# Altium project Piezo_Micropump_Driver_Project.PrjPcb
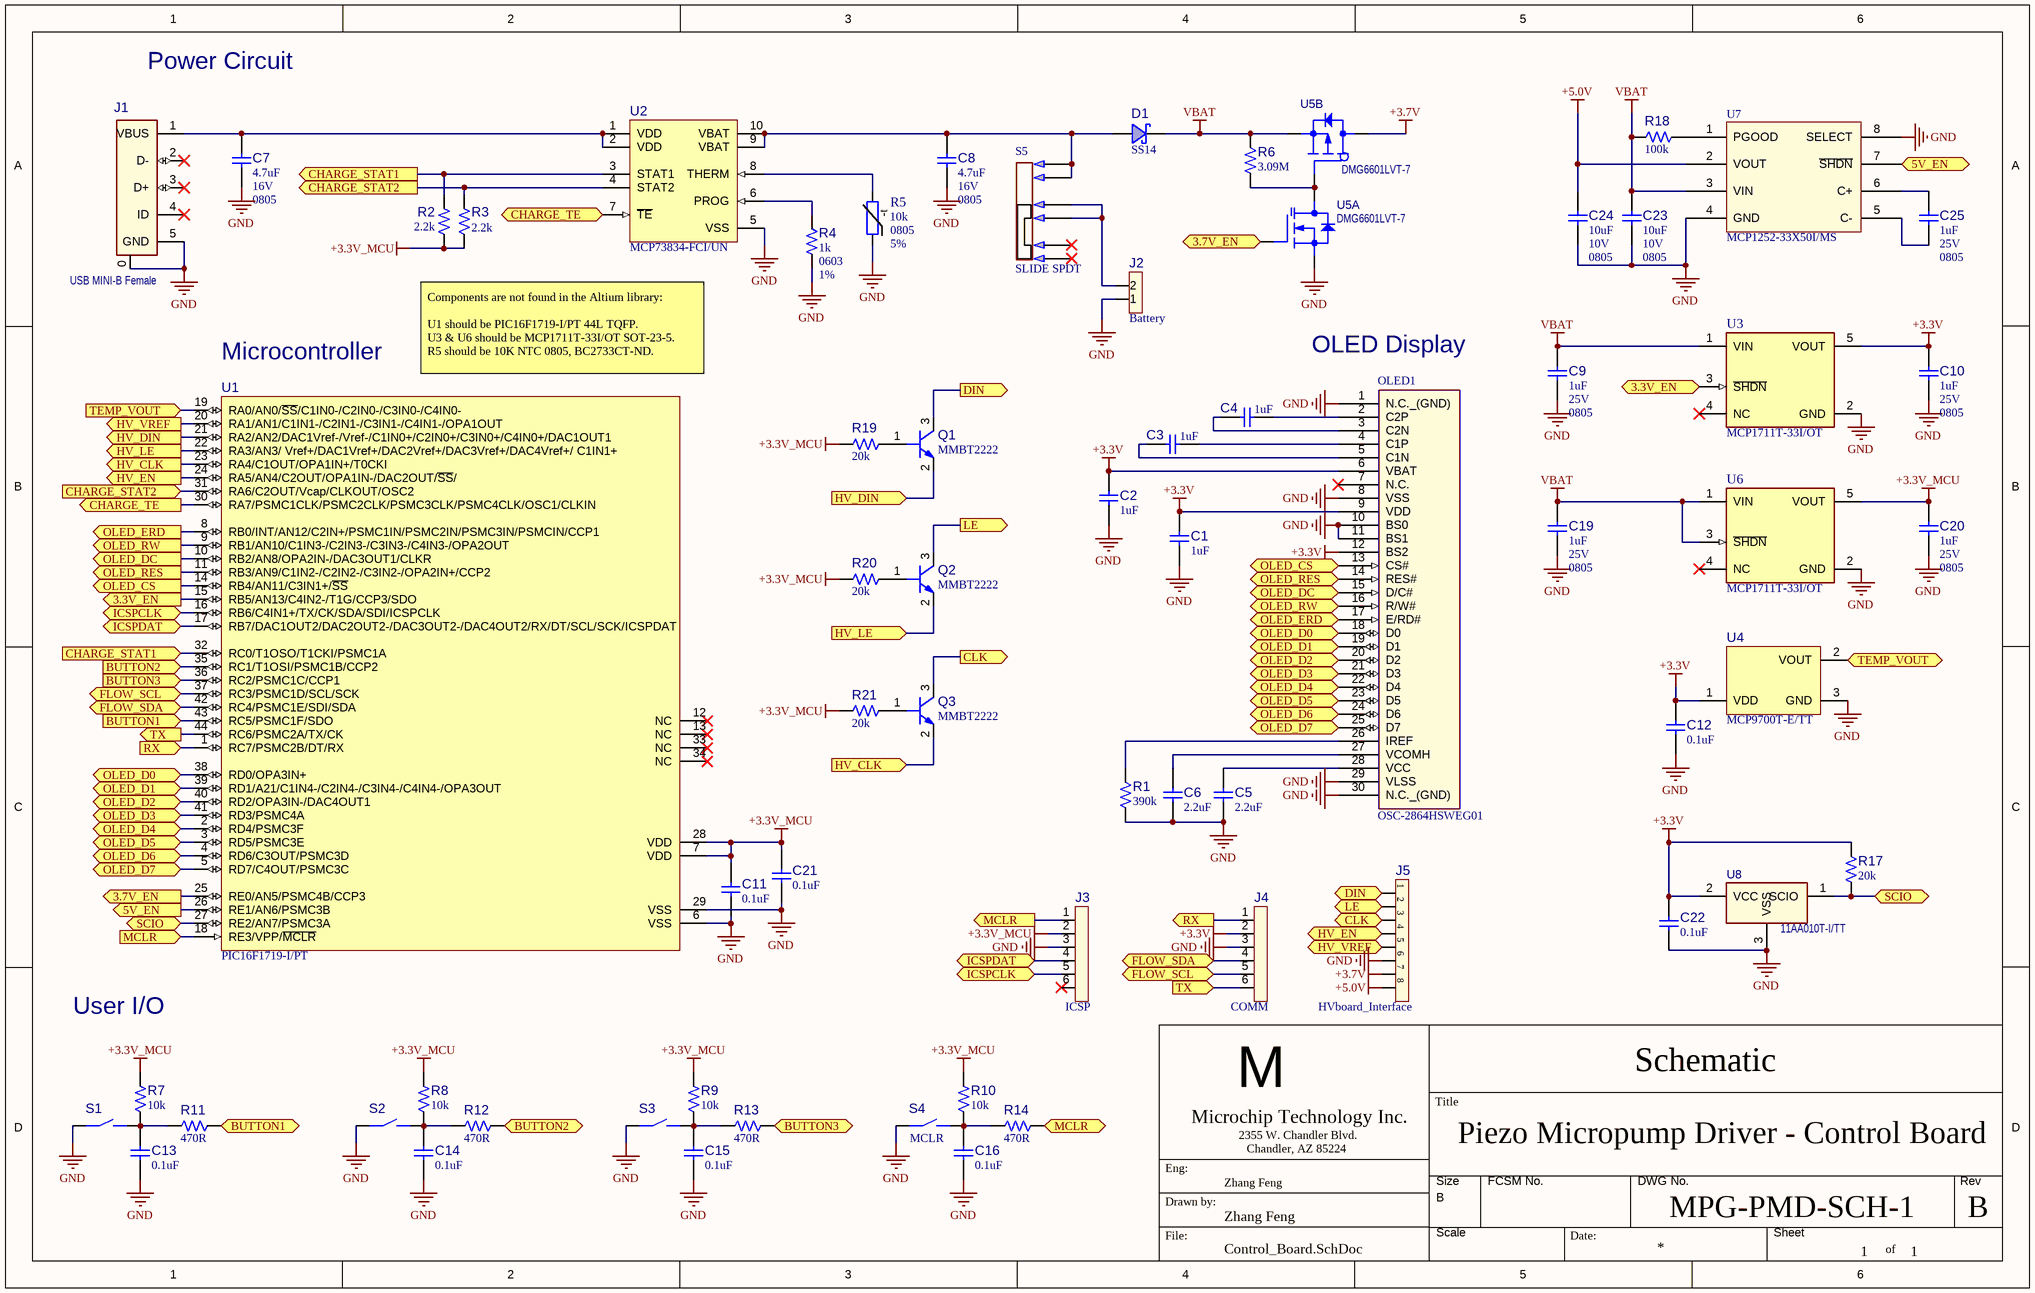
[diagram p0: Control_Board.SchDoc]
1 sheet, 65 parts. Net scope: flat (ports and power ports of the same name join across sheets).
Board file: Control_Board.PcbDoc

## Sheet Control_Board.SchDoc: Piezo Micropump Driver - Control Board
size B; DrawnBy: Zhang Feng; Engineer: Zhang Feng; Organization: Microchip Technology Inc.; Address1: 2355 W. Chandler Blvd.; Address2: Chandler, AZ 85224; DocumentNumber: MPG-PMD-SCH-1; Revision: B; SheetNumber: 1; SheetTotal: 1; DocumentType: Schematic

### Parts
C1  value 1uF  [CAP_C_0603]  (hidden comment: Capacitor NP)
C2  value 1uF  [CAP_C_0603]  (hidden comment: Capacitor NP)
C3  value 1uF  [CAP_C_0603]  (hidden comment: Capacitor NP)
C4  value 1uF  [CAP_C_0603]  (hidden comment: Capacitor NP)
C5  value 2.2uF  [CAP_C_0603]  (hidden comment: Capacitor NP)
C6  value 2.2uF  [CAP_C_0603]  (hidden comment: Capacitor NP)
C7  value 4.7uF  Voltage: 16V  Package: 0805  [CAP_C_0805]  (hidden comment: Capacitor NP)
C8  value 4.7uF  Voltage: 16V  Package: 0805  [CAP_C_0805]  (hidden comment: Capacitor NP)
C9  value 1uF  Voltage: 25V  Package: 0805  [CAP_C_0805]  (hidden comment: Capacitor NP)
C10  value 1uF  Voltage: 25V  Package: 0805  [CAP_C_0805]  (hidden comment: Capacitor NP)
C11  value 0.1uF  [CAP_C_0603]  (hidden comment: Capacitor NP)
C12  value 0.1uF  [CAP_C_0603]  (hidden comment: Capacitor NP)
C13  value 0.1uF  [CAP_C_0603]  (hidden comment: Capacitor NP)
C14  value 0.1uF  [CAP_C_0603]  (hidden comment: Capacitor NP)
C15  value 0.1uF  [CAP_C_0603]  (hidden comment: Capacitor NP)
C16  value 0.1uF  [CAP_C_0603]  (hidden comment: Capacitor NP)
C19  value 1uF  Voltage: 25V  Package: 0805  [CAP_C_0805]  (hidden comment: Capacitor NP)
C20  value 1uF  Voltage: 25V  Package: 0805  [CAP_C_0805]  (hidden comment: Capacitor NP)
C21  value 0.1uF  [CAP_C_0603]  (hidden comment: Capacitor NP)
C22  value 0.1uF  [CAP_C_0603]  (hidden comment: Capacitor NP)
C23  value 10uF  Voltage: 10V  Package: 0805  [CAP_C_0805]  (hidden comment: Capacitor NP)
C24  value 10uF  Voltage: 10V  Package: 0805  [CAP_C_0805]  (hidden comment: Capacitor NP)
C25  value 1uF  Voltage: 25V  Package: 0805  [CAP_C_0805]  (hidden comment: Capacitor NP)
D1  value SS14  [DO-214AC_SMA]  (hidden comment: Diode Schottky)
J1  value USB MINI-B Female  [CON_USB-B_Mini_SMD_RA_HIR_UX60-MB-5ST]  (hidden comment: USB_mini_B)
J2  Battery  [HDR_M_2_1X2_SMD_RA]
J3  ICSP  [HDR_M_2.54_1x6]
J4  COMM  [HDR_M_2.54_1x6]
J5  HVboard_Interface  [HDR_M_2.54_1x8_RA]
OLED1  value OSC-2864HSWEG01  [OLED_2864HSWEG01]  (hidden comment: OLED_2864HSWEG01)
Q1  value MMBT2222  [SOT-23-3]  (hidden comment: Transistor NPN BEC)
Q2  value MMBT2222  [SOT-23-3]  (hidden comment: Transistor NPN BEC)
Q3  value MMBT2222  [SOT-23-3]  (hidden comment: Transistor NPN BEC)
R1  value 390k  [RES_C_0603]  (hidden comment: Resistor)
R2  value 2.2k  [RES_C_0603]  (hidden comment: Resistor)
R3  value 2.2k  [RES_C_0603]  (hidden comment: Resistor)
R4  value 1k  Package: 0603  Tolerance: 1%  [RES_C_0603]  (hidden comment: Resistor)
R5  10k  Package: 0805  Tolerance: 5%  [RES_C_0805]
R6  value 3.09M  [RES_C_0603]  (hidden comment: Resistor)
R7  value 10k  [RES_C_0603]  (hidden comment: Resistor)
R8  value 10k  [RES_C_0603]  (hidden comment: Resistor)
R9  value 10k  [RES_C_0603]  (hidden comment: Resistor)
R10  value 10k  [RES_C_0603]  (hidden comment: Resistor)
R11  value 470R  [RES_C_0603]  (hidden comment: Resistor)
R12  value 470R  [RES_C_0603]  (hidden comment: Resistor)
R13  value 470R  [RES_C_0603]  (hidden comment: Resistor)
R14  value 470R  [RES_C_0603]  (hidden comment: Resistor)
R17  value 20k  [RES_C_0603]  (hidden comment: Resistor)
R18  value 100k  [RES_C_0603]  (hidden comment: Resistor)
R19  value 20k  [RES_C_0603]  (hidden comment: Resistor)
R20  value 20k  [RES_C_0603]  (hidden comment: Resistor)
R21  value 20k  [RES_C_0603]  (hidden comment: Resistor)
S1  Switch 2 Pin  [SW_TACT_SMD_CK_KSR231GLFS]  (value not drawn)
S2  Switch 2 Pin  [SW_TACT_SMD_CK_KSR231GLFS]  (value not drawn)
S3  Switch 2 Pin  [SW_TACT_SMD_CK_KSR231GLFS]  (value not drawn)
S4  MCLR  [SW_TACT_SMD_CK_KSR231GLFS]
S5  value SLIDE SPDT  [SW_SLIDE_TH_ESW_EG1271]  (hidden comment: Switch 6 Pin SPDT)
U1  PIC16F1719-I/PT  [TQFP-44_10x10]
U2  Supplier Part Number 1: MCP73834-FCI/UN  [MSOP-10]  (hidden comment: MCP73834)
U3  MCP1711T-33I/OT  [SOT-23-5]
U4  Manufacturer Part Number 1: MCP9700T-E/TT  [SOT-23-3]  (hidden comment: MCP9700)
U5  Manufacturer Part Number 1: DMG6601LVT-7  [TSOT26]  (hidden comment: MOSFET N/P-CH 30V 26TSOT)  (parts A,B of 2)
U6  MCP1711T-33I/OT  [SOT-23-5]
U7  Manufacturer Part Number 1: MCP1252-33X50I/MS  [MSOP-8]  (hidden comment: MCP1252)
U8  11AA010  [SOT-23-3]  (value not drawn)

### Ports
3.3V_EN (in), 3.3V_EN (out), 3.7V_EN (in), 3.7V_EN (out), 5V_EN (in), 5V_EN (out), BUTTON1 (in), BUTTON1 (out), BUTTON2 (in), BUTTON2 (out), BUTTON3 (in), BUTTON3 (out), CHARGE_STAT1 (in), CHARGE_STAT1 (out), CHARGE_STAT2 (in), CHARGE_STAT2 (out), CHARGE_TE (in), CHARGE_TE (out), CLK (in), CLK (out), DIN (in), DIN (out), FLOW_SCL (bidir), FLOW_SDA (bidir), HV_CLK (in), HV_CLK (out), HV_DIN (in), HV_DIN (out), HV_EN (in), HV_EN (out), HV_LE (in), HV_LE (out), HV_VREF (in), HV_VREF (out), ICSPCLK (bidir), ICSPDAT (bidir), LE (in), LE (out), MCLR (in), MCLR (out), OLED_CS (in), OLED_CS (out), OLED_D0 (bidir), OLED_D1 (bidir), OLED_D2 (bidir), OLED_D3 (bidir), OLED_D4 (bidir), OLED_D5 (bidir), OLED_D6 (bidir), OLED_D7 (bidir), OLED_DC (in), OLED_DC (out), OLED_ERD (in), OLED_ERD (out), OLED_RES (in), OLED_RES (out), OLED_RW (in), OLED_RW (out), RX (in), RX (out), SCIO (bidir), TEMP_VOUT (in), TEMP_VOUT (out), TX (in), TX (out)

### Nets
+3.3V: C1.2 C2.2 C10.2 C12.2 C22.2 J4.2 OLED1.6(VBAT) OLED1.9(VDD) OLED1.12(BS2) R17.2 U3.5(VOUT) U4.1(VDD) U8.2(VCC)
+3.3V_MCU: C11.2 C20.2 C21.2 J3.2 R2.1 R3.1 R7.2 R8.2 R9.2 R10.2 R19.1 R20.1 R21.1 U1.7(VDD) U1.28(VDD) U6.5(VOUT)
+3.7V: J5.7 U5.4(D2_(P))
+5.0V: C24.2 J5.8 U7.2(VOUT)
GND: C1.1 C2.1 C5.1 C6.1 C7.1 C8.1 C9.1 C10.1 C11.1 C12.1 C13.1 C14.1 C15.1 C16.1 C19.1 C20.1 C21.1 C22.1 C23.1 C24.1 J1.0(Shield) J1.5(GND) J2.1 J3.3 J4.3 J5.6 OLED1.1(N.C._(GND)) OLED1.8(VSS) OLED1.10(BS0) OLED1.11(BS1) OLED1.29(VLSS) OLED1.30(N.C._(GND)) R1.1 R4.1 R5.1 S1.1 S2.1 S3.1 S4.1 U1.6(VSS) U1.29(VSS) U2.5(VSS) U3.2(GND) U4.3(GND) U5.5(S1_(N)) U6.2(GND) U7.4(GND) U7.8(SELECT) U8.3(VSS)
VBAT: C9.2 C19.2 C23.2 D1.2(K) R6.2 R18.1 U3.1(VIN) U5.2(S2_(P)) U6.1(VIN) U6.3(~{SHDN}) U7.3(VIN)
NetC3_1: C3.1 OLED1.5(C1N)
NetC3_2: C3.2 OLED1.4(C1P)
NetC4_1: C4.1 OLED1.3(C2N)
NetC4_2: C4.2 OLED1.2(C2P)
NetC5_2: C5.2 OLED1.28(VCC)
NetC6_2: C6.2 OLED1.27(VCOMH)
NetC7_2: C7.2 J1.1(VBUS) U2.1(VDD) U2.2(VDD)
NetC8_2: C8.2 D1.1(A) S5.3 S5.6 U2.9(VBAT) U2.10(VBAT)
NetC13_2: C13.2 R7.1 R11.1 S1.2
NetC14_2: C14.2 R8.1 R12.1 S2.2
NetC15_2: C15.2 R9.1 R13.1 S3.2
NetC16_2: C16.2 R10.1 R14.1 S4.2
NetC25_1: C25.1 U7.5(C-)
NetC25_2: C25.2 U7.6(C+)
NetJ2_2: J2.2 S5.2 S5.5
NetJ3_1: J3.1 R14.2 U1.18(RE3/VPP/~{MCLR}) ; port MCLR
NetJ3_4: J3.4 U1.17(RB7/DAC1OUT2/DAC2OUT2-/DAC3OUT2-/DAC4OUT2/RX/DT/SCL/SCK/ICSPDAT) ; port ICSPDAT
NetJ3_5: J3.5 U1.16(RB6/C4IN1+/TX/CK/SDA/SDI/ICSPCLK) ; port ICSPCLK
NetJ4_1: J4.1 U1.1(RC7/PSMC2B/DT/RX) ; port RX
NetJ4_4: J4.4 U1.42(RC4/PSMC1E/SDI/SDA) ; port FLOW_SDA
NetJ4_5: J4.5 U1.37(RC3/PSMC1D/SCL/SCK) ; port FLOW_SCL
NetJ4_6: J4.6 U1.44(RC6/PSMC2A/TX/CK) ; port TX
NetJ5_1: J5.1 Q1.3(C) ; port DIN
NetJ5_2: J5.2 Q2.3(C) ; port LE
NetJ5_3: J5.3 Q3.3(C) ; port CLK
NetJ5_4: J5.4 U1.24(RA5/AN4/C2OUT/OPA1IN-/DAC2OUT/~{SS}/) ; port HV_EN
NetJ5_5: J5.5 U1.20(RA1/AN1/C1IN1-/C2IN1-/C3IN1-/C4IN1-/OPA1OUT) ; port HV_VREF
NetOLED1_13: OLED1.13(CS#) U1.14(RB4/AN11/C3IN1+/~{SS}) ; port OLED_CS
NetOLED1_14: OLED1.14(RES#) U1.11(RB3/AN9/C1IN2-/C2IN2-/C3IN2-/OPA2IN+/CCP2) ; port OLED_RES
NetOLED1_15: OLED1.15(D/C#) U1.10(RB2/AN8/OPA2IN-/DAC3OUT1/CLKR) ; port OLED_DC
NetOLED1_16: OLED1.16(R/W#) U1.9(RB1/AN10/C1IN3-/C2IN3-/C3IN3-/C4IN3-/OPA2OUT) ; port OLED_RW
NetOLED1_17: OLED1.17(E/RD#) U1.8(RB0/INT/AN12/C2IN+/PSMC1IN/PSMC2IN/PSMC3IN/PSMCIN/CCP1) ; port OLED_ERD
NetOLED1_18: OLED1.18(D0) U1.38(RD0/OPA3IN+) ; port OLED_D0
NetOLED1_19: OLED1.19(D1) U1.39(RD1/A21/C1IN4-/C2IN4-/C3IN4-/C4IN4-/OPA3OUT) ; port OLED_D1
NetOLED1_20: OLED1.20(D2) U1.40(RD2/OPA3IN-/DAC4OUT1) ; port OLED_D2
NetOLED1_21: OLED1.21(D3) U1.41(RD3/PSMC4A) ; port OLED_D3
NetOLED1_22: OLED1.22(D4) U1.2(RD4/PSMC3F) ; port OLED_D4
NetOLED1_23: OLED1.23(D5) U1.3(RD5/PSMC3E) ; port OLED_D5
NetOLED1_24: OLED1.24(D6) U1.4(RD6/C3OUT/PSMC3D) ; port OLED_D6
NetOLED1_25: OLED1.25(D7) U1.5(RD7/C4OUT/PSMC3C) ; port OLED_D7
NetOLED1_26: OLED1.26(IREF) R1.2
NetQ1_1: Q1.1(B) R19.2
NetQ1_2: Q1.2(E) U1.21(RA2/AN2/DAC1Vref-/Vref-/C1IN0+/C2IN0+/C3IN0+/C4IN0+/DAC1OUT1) ; port HV_DIN
NetQ2_1: Q2.1(B) R20.2
NetQ2_2: Q2.2(E) U1.22(RA3/AN3/_Vref+/DAC1Vref+/DAC2Vref+/DAC3Vref+/DAC4Vref+/_C1IN1+) ; port HV_LE
NetQ3_1: Q3.1(B) R21.2
NetQ3_2: Q3.2(E) U1.23(RA4/C1OUT/OPA1IN+/T0CKI) ; port HV_CLK
NetR2_2: R2.2 U1.32(RC0/T1OSO/T1CKI/PSMC1A) U2.3(STAT1) ; port CHARGE_STAT1
NetR3_2: R3.2 U1.31(RA6/C2OUT/Vcap/CLKOUT/OSC2) U2.4(STAT2) ; port CHARGE_STAT2
NetR4_2: R4.2 U2.6(PROG)
NetR5_2: R5.2 U2.8(THERM)
NetR6_1: R6.1 U5.3(G2_(P)) U5.6(D1_(N))
NetR11_2: R11.2 U1.43(RC5/PSMC1F/SDO) ; port BUTTON1
NetR12_2: R12.2 U1.35(RC1/T1OSI/PSMC1B/CCP2) ; port BUTTON2
NetR13_2: R13.2 U1.36(RC2/PSMC1C/CCP1) ; port BUTTON3
NetR17_1: R17.1 U1.27(RE2/AN7/PSMC3A) U8.1(SCIO) ; port SCIO
NetR18_2: R18.2 U7.1(PGOOD)
NetU1_15: U1.15(RB5/AN13/C4IN2-/T1G/CCP3/SDO) U3.3(~{SHDN}) ; port 3.3V_EN
NetU1_19: U1.19(RA0/AN0/~{SS}/C1IN0-/C2IN0-/C3IN0-/C4IN0-) U4.2(VOUT) ; port TEMP_VOUT
NetU1_25: U1.25(RE0/AN5/PSMC4B/CCP3) U5.1(G1_(N)) ; port 3.7V_EN
NetU1_26: U1.26(RE1/AN6/PSMC3B) U7.7(~{SHDN}) ; port 5V_EN
NetU1_30: U1.30(RA7/PSMC1CLK/PSMC2CLK/PSMC3CLK/PSMC4CLK/OSC1/CLKIN) U2.7(~{TE}) ; port CHARGE_TE

Not connected (* = marked no-connect by the designer): J1 2(D-)* 3(D+)* 4(ID)*; J3 6*; OLED1 7(N.C.)*; S5 1* 4*; U1 12(NC)* 13(NC)* 33(NC)* 34(NC)*; U3 4(NC)*; U6 4(NC)*

### Notes on the sheet
- Power Circuit
- (near U1) Microcontroller
- Components are not found in the Altium library:
  U1 should be PIC16F1719-I/PT 44L TQFP.
  U3 & U6 should be MCP1711T-33I/OT SOT-23-5.
  R5 should be 10K NTC 0805, BC2733CT-ND.
- (near OLED1) OLED Display
- User I/O
- (near J4) M
- Title
- Eng:
- File:
- Drawn by:
- Date:
- of
- (in symbol RES1425) -t

### Library data of the parts
C1-C4 = CAP0517: Capacitor; Manufacturer 1: Taiyo Yuden; Manufacturer Part Number 1: EMK107B7105KA-T; Voltage: 16V; Description_: CAP CER 1uF 16V 10% X7R SMD 0603; Tolerance: 10%; Temperature Coeffcient: X7R; Type: Ceramic; Populated: Yes; MCHP-ID: CAP0517; Package: 0603; Revision: 1; Status: Production; ComponentLink1URL: https://chn-vm-apps.microchip.com/mchprepo/parts/Datasheets/mlcc01_e.pdf; ComponentLink1Description: Datasheet; Operating Temperature: -55C to +125C; Category: Capacitor; Manufacturer 2: TDK; Manufacturer Part Number 2: C1608X7R1C105K; Supplier 1: Digi-Key; Supplier Part Number 1: 587-1241-1-ND; Supplier 2: Digi-Key; Supplier Part Number 2: 445-1604-1-ND; Quantity Override: 1
C5 C6 = CAP0597: Capacitor; Manufacturer 1: TDK; Manufacturer Part Number 1: C1608X5R1C225K; Voltage: 16V; Description_: CAP CER 2.2uF 16V 10% X5R SMD 0603; Tolerance: 10%; Temperature Coeffcient: X5R; Type: Ceramic; Populated: Yes; MCHP-ID: CAP0597; Package: 0603; Revision: 2; Status: Production; ComponentLink1URL: https://chn-vm-apps.microchip.com/mchprepo/parts/Datasheets/general_B11.pdf; ComponentLink1Description: Datasheet; Operating Temperature: -55C to +85C; Category: Capacitor; Supplier 1: Digi-Key; Supplier Part Number 1: 445-5157-1-ND; Quantity Override: 1
C7 C8 = CAP0419: Capacitor; Manufacturer 1: Panasonic; Manufacturer Part Number 1: ECJ-2FF1C475Z; Description_: CAP CER 4.7uF 16V 20% Y5V SMD 0805; Tolerance: 20%; Temperature Coeffcient: Y5V; Type: Ceramic; Populated: Yes; MCHP-ID: CAP0419; Revision: 1; Status: Production; ComponentLink1URL: https://chn-vm-apps.microchip.com/mchprepo/parts/Datasheets/ECJ__General_.pdf; ComponentLink1Description: Datasheet; Operating Temperature: -30C to +85C; Category: Capacitor; Supplier 1: Digi-Key; Supplier Part Number 1: PCC2232TR-ND; Quantity Override: 1
C9 C10 C19 C20 C25 = CAP1211: Capacitor; Manufacturer 1: AVX; Manufacturer Part Number 1: 08053C105K4Z2A; Description_: CAP CER 1uF 25V 10% X7R SMD 0805; Tolerance: 10%; Temperature Coeffcient: X7R; Type: Ceramic; Owner: Tad Ahlvers; Populated: YES; MCHP-ID: CAP1211; Revision: 1; Status: MCL Design; ComponentLink1URL: https://chn-vm-apps.microchip.com/mchprepo/parts/Datasheets/flexiterm.pdf; ComponentLink1Description: Datasheet; Operating Temperature: -55C to +125C; Category: Capacitor; Manufacturer 2: KEMET; Manufacturer Part Number 2: C0805C105K3RACTU; Manufacturer 3: TDK Corporation; Manufacturer Part Number 3: C2012X7R1E105K125AB; Supplier 1: Digi-Key; Supplier Part Number 1: 478-6357-2-ND; Supplier 2: Digi-Key; Supplier Part Number 2: C0805C105K3RACTU-ND; Supplier 3: Digi-Key; Supplier Part Number 3: 445-1354-1-ND; Quantity Override: 1
C11-C16 C21 C22 = CAP0011: Capacitor; Manufacturer 1: AVX; Manufacturer Part Number 1: 0603YC104KAT2A; Voltage: 16V; Description_: CAP CER 0.1uF 16V 10% X7R SMD 0603; Tolerance: 10%; Temperature Coeffcient: X7R; Type: Ceramic; Populated: Yes; MCHP-ID: CAP0011; Package: 0603; Revision: 3; Status: Production; ComponentLink1URL: https://chn-vm-apps.microchip.com/mchprepo/parts/Datasheets/nmc2.pdf; ComponentLink1Description: Datasheet; Operating Temperature: -55C to +125C; Category: Capacitor; Manufacturer 2: Murata; Manufacturer Part Number 2: GRM188R71C104KA01D; Manufacturer 3: Panasonic; Manufacturer Part Number 3: ECJ-1VB1C104K; Manufacturer 4: Taiyo Yuden; Manufacturer Part Number 4: EMK107B7104KA-T; Manufacturer 5: Yageo; Manufacturer Part Number 5: CC0603KRX7R7BB104; Manufacturer 6: NIC Components; Manufacturer Part Number 6: NMC0603X7R104K16TRPF; Supplier 1: Digi-Key; Supplier Part Number 1: 478-1239-1-ND; Supplier 2: Digi-Key; Supplier Part Number 2: 490-1532-1-ND; Supplier 3: Digi-Key; Supplier Part Number 3: PCC1762CT-ND; Supplier 4: Digi-Key; Supplier Part Number 4: 587-1240-2-ND; Supplier 5: Newark; Supplier Part Number 5: 86H5248; Supplier 6: Digi-Key; Supplier Part Number 6: 311-1088-1-ND; Supplier 7: NIC Components; Supplier Part Number 7: NMC0603X7R104K16TRPF; Quantity Override: 1
C23 C24 = CAP1148: Capacitor; Manufacturer 1: TDK Corporation; Manufacturer Part Number 1: C2012X7R1A106K125AC; Description_: CAP CER 10uF 10V 10% X7R SMD 0805; Dev Tools Status: Production; Tolerance: 10%; Temperature Coeffcient: X7R; Type: Ceramic; Owner: Mihai T(M91442); Populated: Yes; MCHP-ID: CAP1148; Revision: 0; Status: MCL Design; ComponentLink1URL: https://chn-vm-apps.microchip.com/mchprepo/parts/Datasheets/L0005E.pdf; ComponentLink1Description: Datasheet; Operating Temperature: -55C to +125C; Category: Capacitor; Manufacturer 2: Murata; Manufacturer Part Number 2: GRM21BR71A106KE51L; Supplier 1: Digi-Key; Supplier Part Number 1: 445-6857-1-ND; Supplier 2: Digi-Key; Supplier Part Number 2: 490-3905-1-ND; Supplier 3: Farnell; Supplier Part Number 3: 1828828; Quantity Override: 1
D1 = DIODE0128: Manufacturer 1: Fairchild; Description_: DIO SCTKY SS14 500mV 1A 40V DO-214AC_SMA; Type: Schottky Single; Forward Current: 1A; Power: 1.1W; Reverse Current: 200uA; Reverse Voltage: 40V; Populated: YES; MCHP-ID: DIODE0128; Revision: 1; Status: Production; Package: DO-214AC_SMA; ComponentLink1URL: https://chn-vm-apps.microchip.com/mchprepo/parts/Datasheets/SS12.pdf; ComponentLink1Description: Datasheet; Operating Temperature: -65C to +125C; Category: Diode; Manufacturer Part Number 1: SS14; Supplier 1: Digi-Key; Supplier Part Number 1: SS14CT-ND; Quantity Override: 1
J1 = CON0276: Connector USB; Manufacturer 1: Hirose; Manufacturer Part Number 1: UX60-MB-5ST; Description_: CON USB MINI-B Female SMD R/A; Populated: Yes; MCHP-ID: CON0276; Revision: 2; Status: Production; ComponentLink1URL: https://chn-vm-apps.microchip.com/mchprepo/parts/Datasheets/e24000019.pdf; ComponentLink1Description: Datasheet; Type: USB; Category: Connector; Manufacturer 2: Oupiin; Manufacturer Part Number 2: 8969-B05C00DBU; Supplier 1: Digi-Key; Supplier Part Number 1: H2959CT-ND; Supplier 2: Digi-Key; Supplier Part Number 2: H2959TR-ND; Supplier 3: Oupiin; Supplier Part Number 3: 8969-B05C00DBU; Quantity Override: 1
J2 = CON1434: Manufacturer 1: JST Sales America Inc.; Manufacturer Part Number 1: S2B-PH-SM4-TB(LF)(SN); Value: CONN HDR PH SMD 2MM; Description_: CONN HDR-2 Male 1X2 SMD R/A; Dev Tools Status: Design; Owner: Jose Garcia; Populated: YES; MCHP-ID: CON1434; Revision: 1; Status: MCL Design; ComponentLink1URL: https://chn-vm-apps.microchip.com/mchprepo/parts/Datasheets/ePH; ComponentLink1Description: Datasheet; Type: Header 2mm; Category: Connector; Supplier 1: Digi-Key; Supplier Part Number 1: 455-1749-1-ND; Quantity Override: 1
J3 J4 = CON1106: Manufacturer 1: FCI; Manufacturer Part Number 1: 68001-106HLF; Value: HDR-2.54 Male 1x6; Description_: CON HDR-2.54 Male 1x6 Gold 5.84MH TH VERT; Owner: Bogdan P (M91398); Populated: Yes; MCHP-ID: CON1106; Revision: 0; Status: Production; ComponentLink1URL: https://chn-vm-apps.microchip.com/mchprepo/parts/Datasheets/68000.pdf; ComponentLink1Description: Datasheet; Type: Header 2.54mm; Category: Connector; Supplier 1: Digi-Key; Supplier Part Number 1: 609-3272-ND; Quantity Override: 1
J5 = CON1290: Manufacturer 1: Sullins Connector Solutions; Manufacturer Part Number 1: PBC08SBAN; Value: HDR-2.54 Male 1x8; Description_: CON HDR-2.54 Male 1x8 Gold 5.84MH TH R/A; Owner: Bogdan Popescu; Populated: YES; MCHP-ID: CON1290; Revision: A; Status: Design; ComponentLink1URL: https://chn-vm-apps.microchip.com/mchprepo/parts/Datasheets/97_Page78-79_HEADER_.100_2.54mm_MALE_BREAKAWAY.pdf; ComponentLink1Description: Datasheet; Type: Header 2.54mm; Category: Connector; Supplier 1: Digi-Key; Supplier Part Number 1: S1111E-08-ND; Quantity Override: 1
OLED1 = LCD0034: Manufacturer 1: OSD Displays; Description_: DISPLAY OLED OSC-2864HSWEG01 MNT; Owner: Mike Sullivan (Arena); Populated: YES; MCHP-ID: LCD0034; Revision: 0; Status: Design; ComponentLink1URL: https://chn-vm-apps.microchip.com/mchprepo/parts/Datasheets/OSD-2864HSWEG01.pdf; ComponentLink1Description: Datasheet; Operating Temperature: -30C to +70C; Type: OLED; Category: Display; Manufacturer Part Number 1: OSC-2864HSWEG01; Supplier 1: OSD Displays; Supplier Part Number 1: OSC-2864HSWEG01; Quantity Override: 1
Q1-Q3 = TRA0039: Transistor Bipolar; Manufacturer 1: Fairchild; Description_: TRANS BJT NPN MMBT2222 30V 600mA 350mW SOT-23-3; Dev Tools Status: Production; Type: BJT; Current: 600mA; Power: 350mW; Voltage: 30V; Populated: YES; MCHP-ID: TRA0039; Revision: 2; Status: MCL Design; Package: SOT-23-3; ComponentLink1URL: https://chn-vm-apps.microchip.com/mchprepo/parts/Datasheets/MMBT2222.pdf; ComponentLink1Description: Datasheet; Operating Temperature: -55C to +150C; Category: Transistor; Manufacturer Part Number 1: MMBT2222; Supplier 1: Fairchild; Supplier Part Number 1: MMBT2222; Quantity Override: 1
R1 = RSMT0758: Manufacturer 1: Panasonic; Manufacturer Part Number 1: ERJ-3EKF3903V; Tolerance: 1%; Description_: RES TKF 390k 1% 1/10W SMD 0603; Voltage: 75V; Temperature Coeffcient: 100ppm/C; Power: 1/10W; Populated: Yes; MCHP-ID: RSMT0758; Package: 0603; Revision: 1; Status: Production; ComponentLink1URL: https://chn-vm-apps.microchip.com/mchprepo/parts/Datasheets/AOA0000CE2.pdf; ComponentLink1Description: Datasheet; Operating Temperature: -55C to +155C; Category: Resistor; Type: RES SMD; Composition: TKF; Supplier 1: Digi-Key; Supplier Part Number 1: P390KHCT-ND; Quantity Override: 1
R2 R3 = RES1130: Manufacturer 1: Panasonic; Manufacturer Part Number 1: ERJ-3EKF2201V; Tolerance: 1%; Description_: RES TKF 2.2k 1% 1/10W SMD 0603; Voltage: 75V; Temperature Coeffcient: 100ppm/C; Power: 1/10W; Owner: Bogdan P (M91398); Populated: Yes; MCHP-ID: RES1130; Package: 0603; Revision: 0; Status: Production; ComponentLink1URL: https://chn-vm-apps.microchip.com/mchprepo/parts/Datasheets/AOA0000CE2.pdf; ComponentLink1Description: Datasheet; Operating Temperature: -55C to +155C; Category: Resistor; Type: RES SMD; Composition: TKF; Supplier 1: Digi-Key; Supplier Part Number 1: P2.20KHCT-ND; Quantity Override: 1
R4 = RSMT0138: Manufacturer 1: Panasonic; Manufacturer Part Number 1: ERJ-3EKF1001V; Description_: RES TKF 1k 1% 1/10W SMD 0603; Voltage: 75V; Temperature Coeffcient: 100ppm/C; Power: 1/10W; Populated: Yes; MCHP-ID: RSMT0138; Revision: 2; Status: Production; ComponentLink1URL: https://chn-vm-apps.microchip.com/mchprepo/parts/Datasheets/AOA0000CE2.pdf; ComponentLink1Description: Datasheet; Operating Temperature: -55C to +155C; Category: Resistor; Type: RES SMD; Composition: TKF; Manufacturer 2: Yageo; Manufacturer Part Number 2: RC0603FR-071KL; Manufacturer 3: ROHM; Manufacturer Part Number 3: MCR03EZPFX1001; Manufacturer 4: Stackpole Electronics Inc; Manufacturer Part Number 4: RMCF0603FT1K00; Manufacturer 5: Stackpole Electronics Inc; Manufacturer Part Number 5: RMCF 1/16 1K 1% R; Manufacturer 6: Vishay; Manufacturer Part Number 6: CRCW06031K00FKEA; Manufacturer 7: Stackpole Electronics Inc; Manufacturer Part Number 7: RMCF1/161.0K1%TR; Supplier 1: Digi-Key; Supplier Part Number 1: P1.00KHCT-ND; Supplier 2: Digi-Key; Supplier Part Number 2: P1.00KHTR-ND; Supplier 3: Digi-Key; Supplier Part Number 3: 311-1.00KHRCT-ND; Supplier 4: Digi-Key; Supplier Part Number 4: RHM1.00KHCT-ND; Supplier 5: Digi-Key; Supplier Part Number 5: RMCF1/161KFRTR-ND; Supplier 6: Digi-Key; Supplier Part Number 6: RMCF0603FT1K00TR-ND; Supplier 7: Newark; Supplier Part Number 7: 52K8015; Supplier 8: Stackpole Electronics Inc; Supplier Part Number 8: RMCF1/161.0K1%TR; Quantity Override: 1
R5 = RES1425: Manufacturer 1: Vishay BC Components; Manufacturer Part Number 1: NTCS0805E3473JHT; Value: 47k; Description_: RES THERMISTOR 47K 5% 210mW SMD 0805; Temperature Coeffcient: NTC; Circuit Type: Isolated; Power: 210mW; Owner: Stephen Humberd; Populated: YES; MCHP-ID: RES1425; Revision: B; Status: Design; ComponentLink1URL: https://chn-vm-apps.microchip.com/mchprepo/parts/Datasheets/ntcs0805e3t.pdf; ComponentLink1Description: Datasheet; Operating Temperature: -40C to +150C; Category: Resistor; Type: Thermistor; Composition: C; Supplier 1: Digi-Key; Supplier Part Number 1: BC2297CT-ND; Quantity Override: 1
R6 = RSMT1115: Manufacturer 1: Vishay Dale; Manufacturer Part Number 1: CRCW06033M09FKEA; Tolerance: 1%; Description_: RES TKF 3.09M 1% 1/10W SMD 0603; Voltage: 75V; Temperature Coeffcient: 100ppm/C; Power: 1/10W; Owner: Bogdan Popescu; Populated: YES; MCHP-ID: RSMT1115; Package: 0603; Revision: A; Status: Design; ComponentLink1URL: https://chn-vm-apps.microchip.com/mchprepo/parts/Datasheets/dcrcwe3.pdf; ComponentLink1Description: Datasheet; Operating Temperature: -55C to +155C; Category: Resistor; Type: RES SMD; Composition: TKF; Supplier 1: Digi-Key; Supplier Part Number 1: 541-3.09MHCT-ND; Quantity Override: 1
R7-R10 = RSMT0139: Manufacturer 1: Panasonic; Manufacturer Part Number 1: ERJ-3EKF1002V; Tolerance: 1%; Description_: RES TKF 10k 1% 1/10W SMD 0603; Temperature Coeffcient: 100ppm/C; Power: 1/10W; Populated: Yes; MCHP-ID: RSMT0139; Package: 0603; Revision: 2; Status: Production; ComponentLink1URL: https://chn-vm-apps.microchip.com/mchprepo/parts/Datasheets/nrc.pdf; ComponentLink1Description: Datasheet; Operating Temperature: -55C to +155C; Category: Resistor; Type: RES SMD; Composition: TKF; Manufacturer 2: Stackpole Electronics Inc; Manufacturer Part Number 2: RMCF0603FT10K0; Manufacturer 3: Yageo; Manufacturer Part Number 3: RC0603FR-0710KL; Manufacturer 4: Stackpole Electronics Inc; Manufacturer Part Number 4: RMCF 1/16 10K 1% R; Manufacturer 5: Xicon; Manufacturer Part Number 5: 302-10K-RC; Manufacturer 6: NIC Components; Manufacturer Part Number 6: NRC06F1002TRF; Supplier 1: Digi-Key; Supplier Part Number 1: P10.0KHCT-ND; Supplier 2: Digi-Key; Supplier Part Number 2: RMCF1/1610KFRTR-ND; Supplier 3: Digi-Key; Supplier Part Number 3: 311-10.0KHRCT-ND; Supplier 4: Digi-Key; Supplier Part Number 4: RMCF0603FT10K0TR-ND; Supplier 5: Mouser; Supplier Part Number 5: 302-10k-RC; Supplier 6: NIC Components; Supplier Part Number 6: NRC06F1002TRF; Quantity Override: 1
R11-R14 = RSMT0518: Manufacturer 1: Yageo; Manufacturer Part Number 1: RC0603FR-07470RL; Tolerance: 1%; Description_: RES TKF 470R 1% 1/10W SMD 0603; Voltage: 50V; Temperature Coeffcient: 100ppm/C; Power: 1/10W; Populated: Yes; MCHP-ID: RSMT0518; Package: 0603; Revision: 1; Status: Production; ComponentLink1URL: https://chn-vm-apps.microchip.com/mchprepo/parts/Datasheets/PYu-RC0603_51_RoHS_L_4.pdf; ComponentLink1Description: Datasheet; Operating Temperature: -55C to +155C; Category: Resistor; Type: RES SMD; Composition: TKF; Manufacturer 2: Panasonic; Manufacturer Part Number 2: ERJ-3EKF4700V; Manufacturer 3: Stackpole Electronics Inc; Manufacturer Part Number 3: RMCF0603FT470R; Supplier 1: Digi-Key; Supplier Part Number 1: 311-470HRCT-ND; Supplier 2: Digi-Key; Supplier Part Number 2: P470HCT-ND; Supplier 3: Digi-Key; Supplier Part Number 3: RMCF1/16470FRTR-ND; Quantity Override: 1
R17 = RSMT0309: Manufacturer 1: Yageo; Manufacturer Part Number 1: 9C06031A2002FKHFT; Tolerance: 1%; Description_: RES TKF 20k 1% 1/10W SMD 0603; Voltage: 50V; Temperature Coeffcient: 100ppm/C; Power: 1/10W; Populated: Yes; MCHP-ID: RSMT0309; Package: 0603; Revision: 1; Status: Production; ComponentLink1URL: https://chn-vm-apps.microchip.com/mchprepo/parts/Datasheets/PYu-RC0603_51_RoHS_L_4.pdf; ComponentLink1Description: Datasheet; Operating Temperature: -55C to +155C; Category: Resistor; Type: RES SMD; Composition: TKF; Manufacturer 2: Yageo; Manufacturer Part Number 2: RC0603FR-0720KL; Manufacturer 3: Yageo; Manufacturer Part Number 3: 9C06031A2002FKPFT; Manufacturer 4: Stackpole Electronics Inc; Manufacturer Part Number 4: RMCF1/1620.0K1%TR; Manufacturer 5: Panasonic; Manufacturer Part Number 5: ERJ-3EKF2002V; Supplier 1: Digi-Key; Supplier Part Number 1: 311-20.0KHTR-ND; Supplier 2: Yageo; Supplier Part Number 2: RC0603FR-0720KL; Supplier 3: Digi-Key; Supplier Part Number 3: 311-20.0KHRCT-ND; Supplier 4: Yageo; Supplier Part Number 4: 9C06031A2002FKPFT; Supplier 5: Stackpole Electronics Inc; Supplier Part Number 5: RMCF1/1620.0K1%TR; Supplier 6: Digi-Key; Supplier Part Number 6: P20.0KHCT-ND; Quantity Override: 1
R18 = RES1066: Manufacturer 1: Vishay; Manufacturer Part Number 1: MCT06030C1003FP500; Tolerance: 1%; Description_: RES TF 100k 1% 1/8W SMD 0603; Voltage: 75V; Temperature Coeffcient: 50ppm/C; Power: 1/8W; Owner: Tad Ahlvers; Populated: Yes; MCHP-ID: RES1066; Package: 0603; Revision: 1; Status: Production; ComponentLink1URL: https://chn-vm-apps.microchip.com/mchprepo/parts/Datasheets/mc_pro.pdf; ComponentLink1Description: Datasheet; Operating Temperature: -55C to +155C; Category: Resistor; Type: RES SMD; Composition: TF; Supplier 1: Digi-Key; Supplier Part Number 1: MCT0603-100K-CFTR-ND; Quantity Override: 1
R19-R21 = RSMT0309: Manufacturer 1: Panasonic; Manufacturer Part Number 1: ERJ-3EKF2002V; Tolerance: 1%; Description_: RES TKF 20k 1% 1/10W SMD 0603; Dev Tools Status: Production; Voltage: 50V; Temperature Coeffcient: 100ppm/C; Power: 1/10W; Populated: Yes; MCHP-ID: RSMT0309; Package: 0603; Revision: 1; Status: MCL Design; ComponentLink1URL: https://chn-vm-apps.microchip.com/mchprepo/parts/Datasheets/PYu-RC0603_51_RoHS_L_4.pdf; ComponentLink1Description: Datasheet; Operating Temperature: -55C to +155C; Category: Resistor; Type: RES SMD; Composition: TKF; Manufacturer 2: Yageo; Manufacturer Part Number 2: 9C06031A2002FKHFT; Manufacturer 3: Yageo; Manufacturer Part Number 3: RC0603FR-0720KL; Manufacturer 4: Stackpole Electronics Inc; Manufacturer Part Number 4: RMCF1/1620.0K1%TR; Manufacturer 5: Yageo; Manufacturer Part Number 5: 9C06031A2002FKPFT; Supplier 1: Digi-Key; Supplier Part Number 1: P20.0KHCT-ND; Supplier 2: Digi-Key; Supplier Part Number 2: 311-20.0KHTR-ND; Supplier 3: Digi-Key; Supplier Part Number 3: 311-20.0KHRCT-ND; Supplier 4: Yageo; Supplier Part Number 4: RC0603FR-0720KL; Supplier 5: Stackpole Electronics Inc; Supplier Part Number 5: RMCF1/1620.0K1%TR; Supplier 6: Yageo; Supplier Part Number 6: 9C06031A2002FKPFT; Quantity Override: 1
S1-S4 = SWITCH1040: Switch; Manufacturer 1: TE Connectivity / Alcoswitch; Value: 147873-1; Description_: SWITCH TACT SPST 24V 50mA 147873-1 SMD; Owner: Stephen Humberd; Voltage: 24V; Current: 50mA; Populated: YES; MCHP-ID: SWITCH1040; Revision: 1; Status: Production; ComponentLink1URL: https://chn-vm-apps.microchip.com/mchprepo/parts/Datasheets/NG_CD_147873_K3-196492.pdf; ComponentLink1Description: Datasheet; Category: Switch; Type: Pushbutton; Manufacturer Part Number 1: 147873-1; Supplier 1: Mouser; Supplier Part Number 1: 506-147873-1; Quantity Override: 1
S5 = SWITCH0051: Switch, Slide, SPDT, TH; Manufacturer 1: E-Switch; Manufacturer Part Number 1: EG1271; Description_: SWITCH SLIDE DPDT 30V 300mA EG1271 TH; Dev Tools Status: Production; Voltage: 30V; Current: 300mA; Populated: YES; MCHP-ID: SWITCH0051; Revision: 1; Status: MCL Design; ComponentLink1URL: https://chn-vm-apps.microchip.com/mchprepo/parts/Datasheets/EG.pdf; ComponentLink1Description: Datasheet; Operating Temperature: -20C to +70C; Category: Switch; Type: Slide; Supplier 1: Digi-Key; Supplier Part Number 1: EG1918-ND; Quantity Override: 1
U1 = MIC6241: PIC16F; Manufacturer 1: Microchip Technology; Value: PIC16F1789-I/PT; Description_: MCHP MCU 8-BIT 28K 2K PIC16F1789-I/PT 44TQFP; MAPS Description: 44-pin, 28KB Flash, 2KB RAM, 256 EEPROM, 12-bit DAC, 5-bit DAC, PSMC, OPAmp,; Owner: Jamus Griego; MPC: LECM17T4XAXX; LeadContent: Pb-FREE; TempRange: -40C to +85C; Stage: REL; PackageWidth: 10x10x1mm; PackingMedia: TRAY; ForceMinOrderQtyMult: True; MinOrderQty: 160; LeadCount: 44; Program Memory KBytes: 28; Program Memory KWords: 16; Ram: 2048; EEPROM: 256; IOPins: 36; MaxSpeed: 32; OscillatorMHz: 32 MHz, 32 kHz; Comparators: 4; ADC Channels: 14; ADCBit: 12; USART: 1; CAN: 0; DigitalTimerQty_8bit: 2; Populated: YES; MCHP-ID: MIC6241; Type: 8-Bit; Status: Design; Revision: B; Category: MCHP-Microcontroller; ComponentLink1URL: http://www.microchip.com/wwwproducts/Devices.aspx?product=PIC16F1789; ComponentLink1Description: Datasheet; Manufacturer Part Number 1: PIC16F1789-I/PT; Supplier 1: Digi-Key; Supplier Part Number 1: PIC16F1789-I/PT-ND; IntroductionDate: 2013-04-04; PackageType: TQFP; Family: Enhanced Mid-Range; DAChannels: 4; SPI: 1; I2C: 1; USBChannels: 0; Input Capture: 0; PWM Channels: 0; mtrlcntrlpwmchannels: 14; SMPS PWM Channels: 14; QEI Channels: 0; SegmentLCD: 0; CapTouchCH: 14; DigitalTimerQty_16bit: 1; DigitalTimerQty_32bit: 0; Quantity Override: 1
U2 = MIC3178: MCP738XX; Manufacturer 1: Microchip; Manufacturer Part Number 1: MCP73833-FCI/UN; Value: MCP73833; Description_: MCHP ANALOG BATTERY CHARGER MCP73833T-FCI/UN MSOP-10; MAPS Description: 1A ADVANCED SINGLE CELL, FULLY INTEGRATED LI-ION POLYMER CHANGE MANAGEMENT CONTR; MPC: DECJ27E3XAFC; LeadContent: Pb-FREE; PackingMedia: TUBE; Stage: REL; LeadCount: 10; PackageWidth: 3x3mm; ForceMinOrderQtyMult: False; MinOrderQty: 5; TempRange: -40C to +85C; tblDeviceFamilyID: 1704; NumberofLiIonCells: 1; UVLO: 3.5; VccRangeMax: 6; VccRangeMin: 3.75; VoltageRegulationTyp: 4.2, 4.35, 4.4, 4.5; VolRegAccuracy: 0.75; IoutMax: 1200; OperatingCurrentTyp: 2; ReverseDischargeCurrentTyp: 0.200000002980232; PassTransistor: INT; MaxThermalRegulation: Yes; MCHP-ID: MIC3178; Type: Battery Charger; Status: Production; Revision: 0; Category: MCHP-Analog; ComponentLink1URL: http://www.microchip.com/wwwproducts/Devices.aspx?product=MCP73833; ComponentLink1Description: Datasheet; Manufacturer 2: Microchip; Manufacturer Part Number 2: MCP73833T-FCI/UN; Supplier 1: Microchip; Supplier 2: Microchip; Supplier Part Number 2: MCP73833T-FCI/UN; IntroductionDate: 2006-09-05; PackageType: MSOP; Technology: Linear; PreconditionCharge: Yes; ChargeTermination: Yes; AutomaticRecharge: Yes; TempMonitor: Yes; ChargeSafetyTimers: Yes; StatusOutput: Yes; ShutdownMode: Yes; SupplyPresent: Yes; ChargeMonitor: Yes; Populated: Yes; Quantity Override: 1
U3 U6 = MIC6434: LDO MCP1711; Manufacturer 1: Microchip Technology; Manufacturer Part Number 1: MCP1711T-18I/OT; Value: MCP1711/1.8V; Description_: MCHP ANALOG LDO 1.8V MCP1711T-18I/OT SOT-23-5; MAPS Description: 600 nA Low Quiescent Current LDO; Owner: Sorin Stanoaia; MPC: YZ026TC7XA18; LeadContent: Pb-FREE; PackingMedia: T/R; Stage: REL; LeadCount: 5; ForceMinOrderQtyMult: True; TempRange: -40C to +85C; tblDeviceFamilyID: 5913; Comments: New device; SingleDual: Single; SHDN: Yes; ResetOutput: No; VoutMin: 1.2; OutputCurrent: 150; Accuracy: 1; OutputCapType: CER/AL/TANT; VOUTtyp: 3.3; TypicalActiveCurrent: 0.6; Dropoutvoltage: 500; MinInputVoltage: 1.4; MaxInputVoltage: 6; MCHP-ID: MIC6434; Type: LDO; Status: Production; Revision: 1; Category: MCHP-Analog; ComponentLink1URL: http://www.microchip.com/wwwproducts/Devices.aspx?product=MCP1711; ComponentLink1Description: Datasheet; Supplier 1: Digi-Key; Supplier Part Number 1: MCP1711T-18I/OTCT-ND; IntroductionDate: 2015-05-06; PackageType: SOT-23; MinOrderQty: 5; VoutMax: 5; Adjustable: No; Populated: YES; Quantity Override: 1
U4 = MIC0740: MCP97XX; Manufacturer 1: Microchip; Description_: MCHP ANALOG TEMPERATURE SENSOR -40C to +150C MCP9700T-E/TT SOT-23-3; MAPS Description: LENEAR ACTIVE THERMISTER 9TM) IC(10MV/OC); MPC: GBAT1YC6XA00; LeadContent: Pb-FREE; PackingMedia: T/R; Stage: REL; LeadCount: 3; ForceMinOrderQtyMult: True; MinOrderQty: 5; TempRange: -40C to +125C; tblDeviceFamilyID: 1068; Comments: Low cost; VccRangeMax: 5.5; VccRangeMin: 2.3; SensorOutput: Analog; TypicalAccuracy: 1; MaxAccuracy_25C: 4; MaxSupplyCurrent: 6; Slope: 10; Offset: 500; Populated: Yes; MCHP-ID: MIC0740; Value: MCP9700; Type: Temperature Sensor; Status: Production; Revision: 1; Category: MCHP-Analog; ComponentLink1URL: http://www.microchip.com/wwwproducts/Devices.aspx?product=MCP9700; ComponentLink1Description: Datasheet; Supplier 1: Microchip; Supplier Part Number 1: MCP9700T-E/TT; IntroductionDate: 2007-05-01; PackageType: SOT-23; Quantity Override: 1
U5 = MOSFET N/P-CH 30V: Manufacturer 1: Diodes Inc.; Supplier 1: Digi-Key; Supplier Part Number 1: DMG6601LVT-7DICT-ND; Description_: MOSFET N/P-CH 30V 26TSOT
U7 = MIC6473: Low-Noise, Positive-Regulated Charge Pump; Manufacturer 1: Microchip Technology; Value: MCP1252-33X50; Description_: MCHP ANALOG CHARGE PUMP 3.3V/5V MCP1252-33X50I/MS MSOP-8; MAPS Description: Positive regulated charge pump; Owner: Jamus Griego; MPC: Y4BD17A3XB00; LeadContent: Pb-FREE; PackingMedia: TUBE; Stage: REL; LeadCount: 8; PackageWidth: 3x3mm; ForceMinOrderQtyMult: False; MinOrderQty: 5; TempRange: -40C to +85C; tblDeviceFamilyID: 222; UVLO: No; SingleDual: Single; SHDN: Yes; ResetOutput: PG; InputVoltageRangeMin: 2.1; InputVoltageRangeMax: 5.5; VoutMin: 1.5; OutputCurrent: 120; Accuracy: 0.5; QuiescentCurrent: 80; ControlPWM: NA; SwitchingFrequency: 650; OutputCapType: Low ESR; MCHP-ID: MIC6473; Type: Voltage Regulator; Status: Design; Revision: A; Category: MCHP-Analog; ComponentLink1URL: http://www.microchip.com/wwwproducts/Devices.aspx?product=MCP1252; ComponentLink1Description: Datasheet; Supplier 1: Digi-Key; Supplier Part Number 1: MCP1252-33X50I/MS-ND; IntroductionDate: 2002-11-27; PackageType: MSOP; Topology: Regulated; VoutMax: 5.5; Adjustable: Yes; ExternalSync: No; Populated: YES; Quantity Override: 1
U8 = 11AA010T-I/TT: IC EEPROM 1KBIT 100KHZ SOT23-3; Manufacturer 1: Microchip; Revision: 0; Supplier 1: Digi-Key; Supplier Part Number 1: 11AA010T-I/TTCT-ND; Manufacturer Part Number 1: 11AA010T-I/TT